# EasyEDA schematic NakujaN2.json

## Sheets
1 ESP: TITLE: Sheet_1; REV: 1.0; Date: 2022-04-05; Sheet: 1/1; Drawn By: Rodney Osodo; Company: Your Company
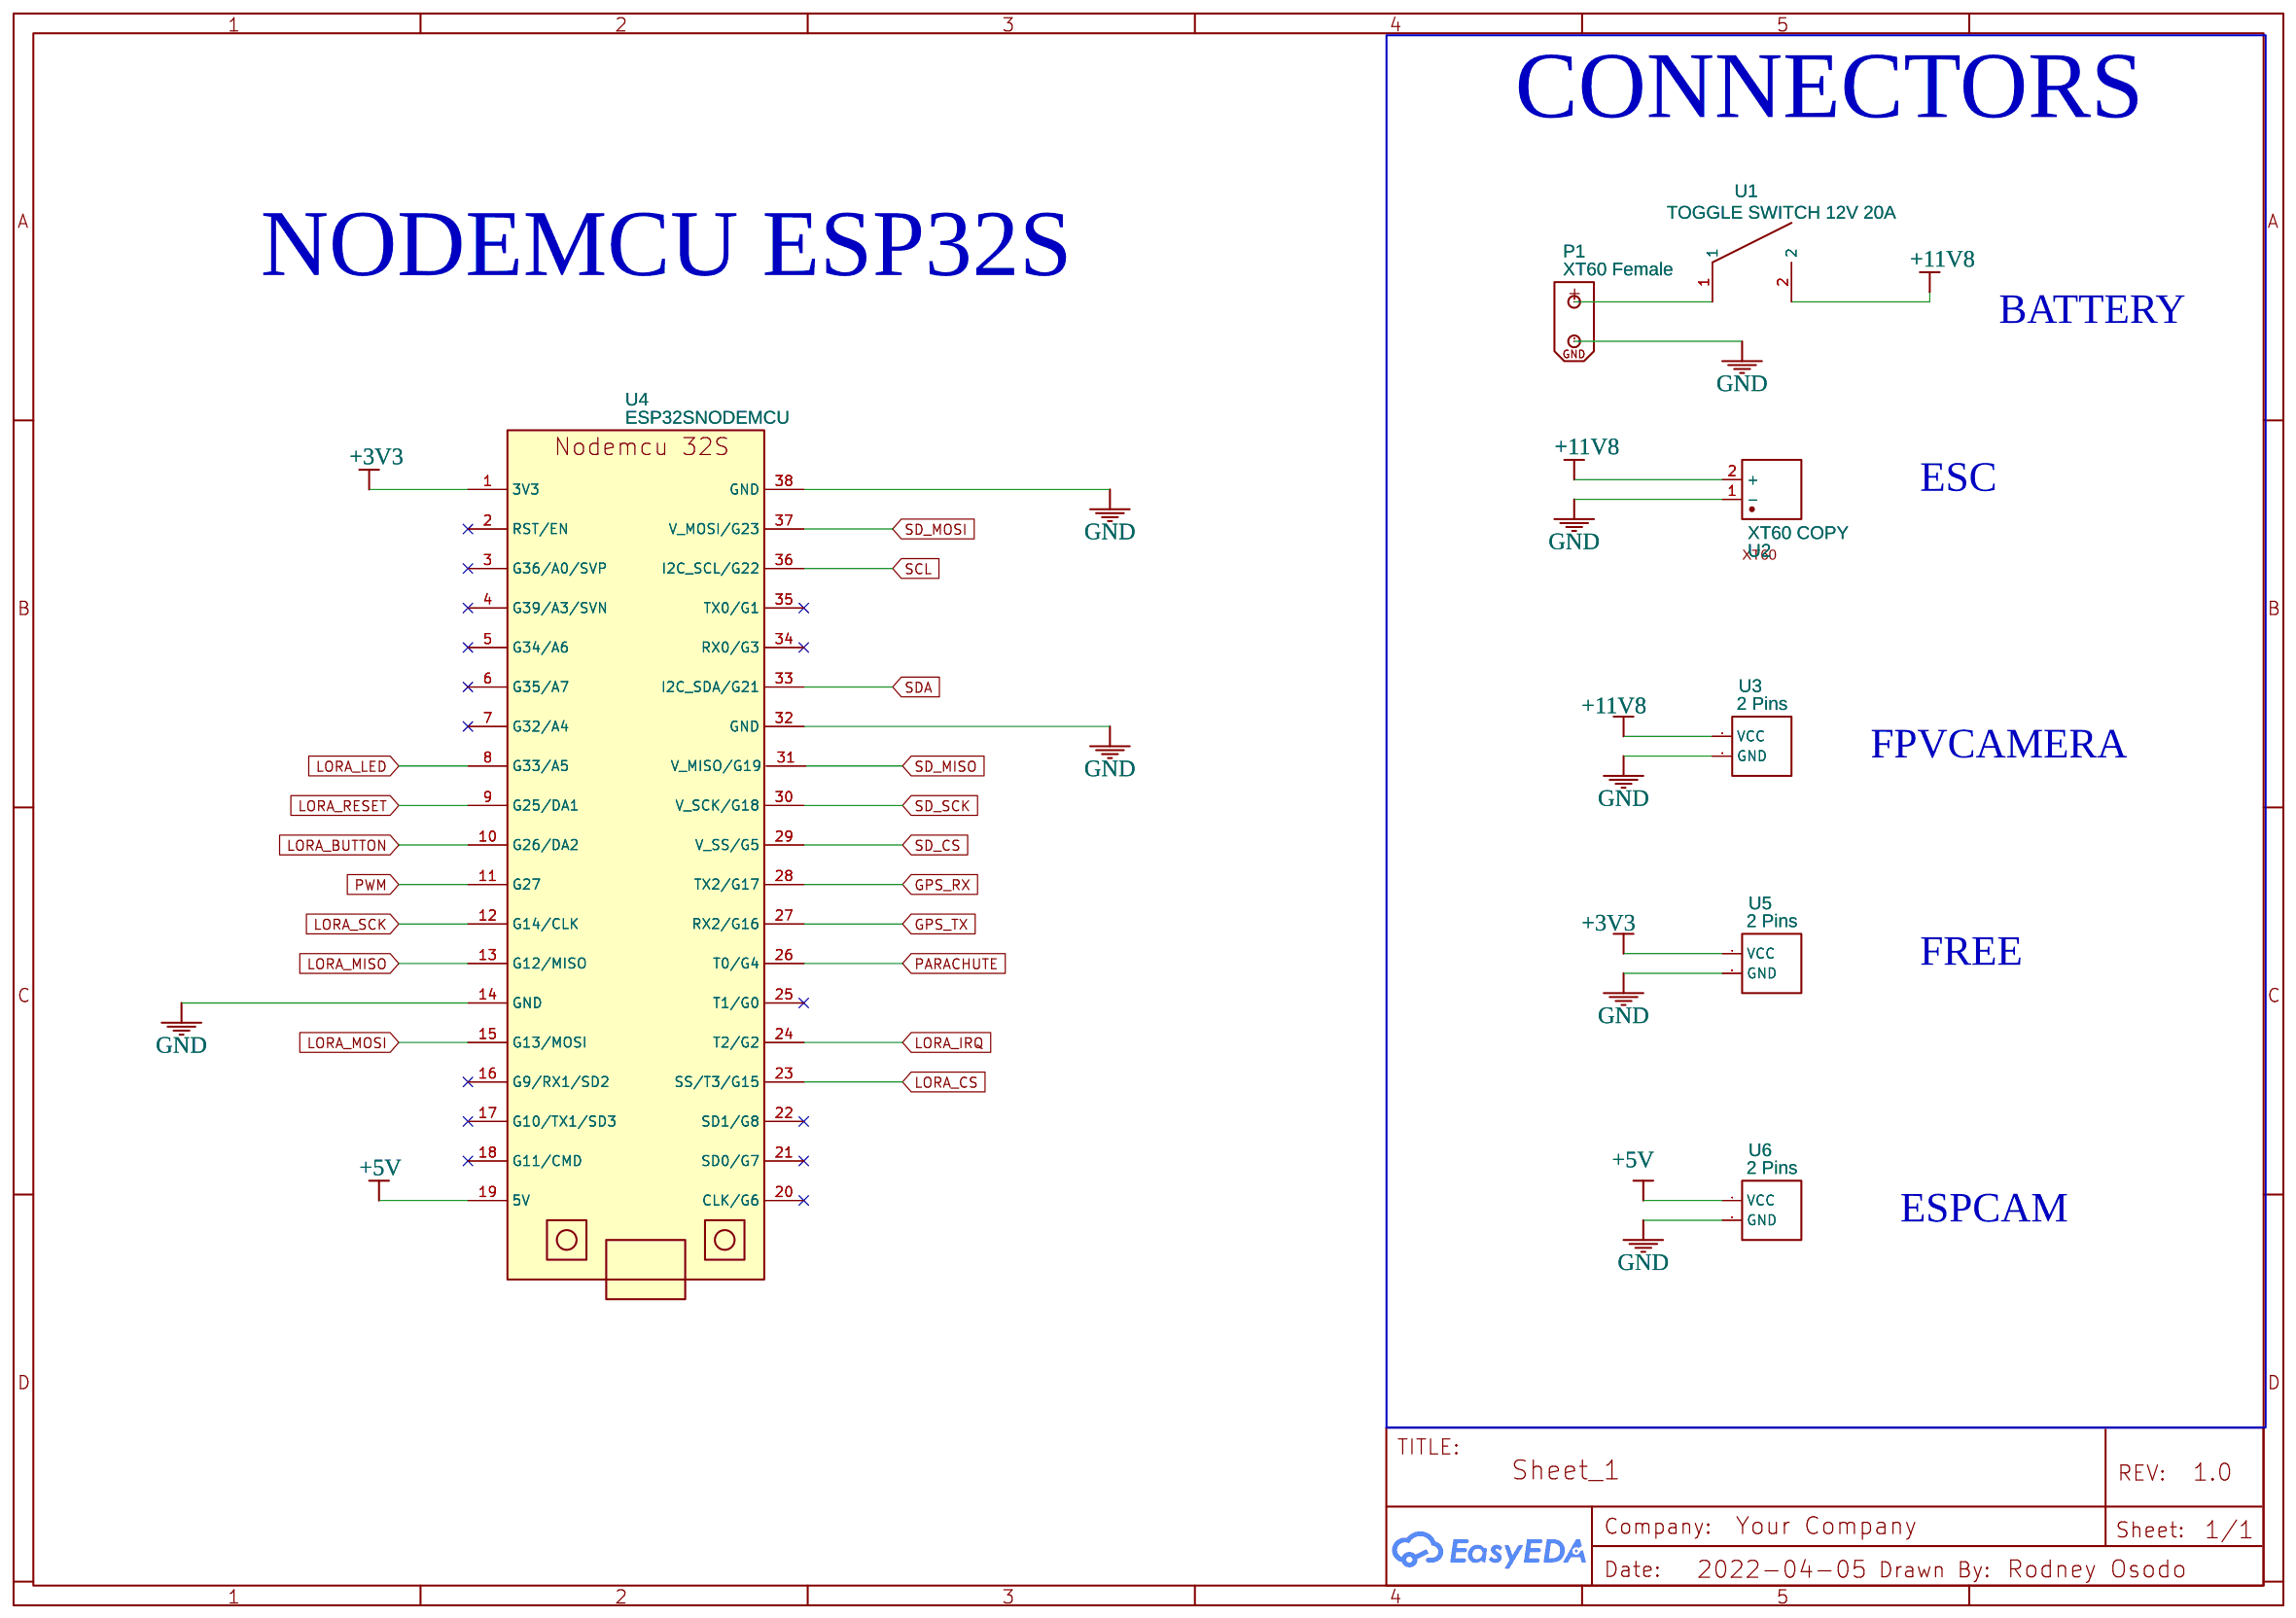
[diagram p0: ESP]
2 SENSORS
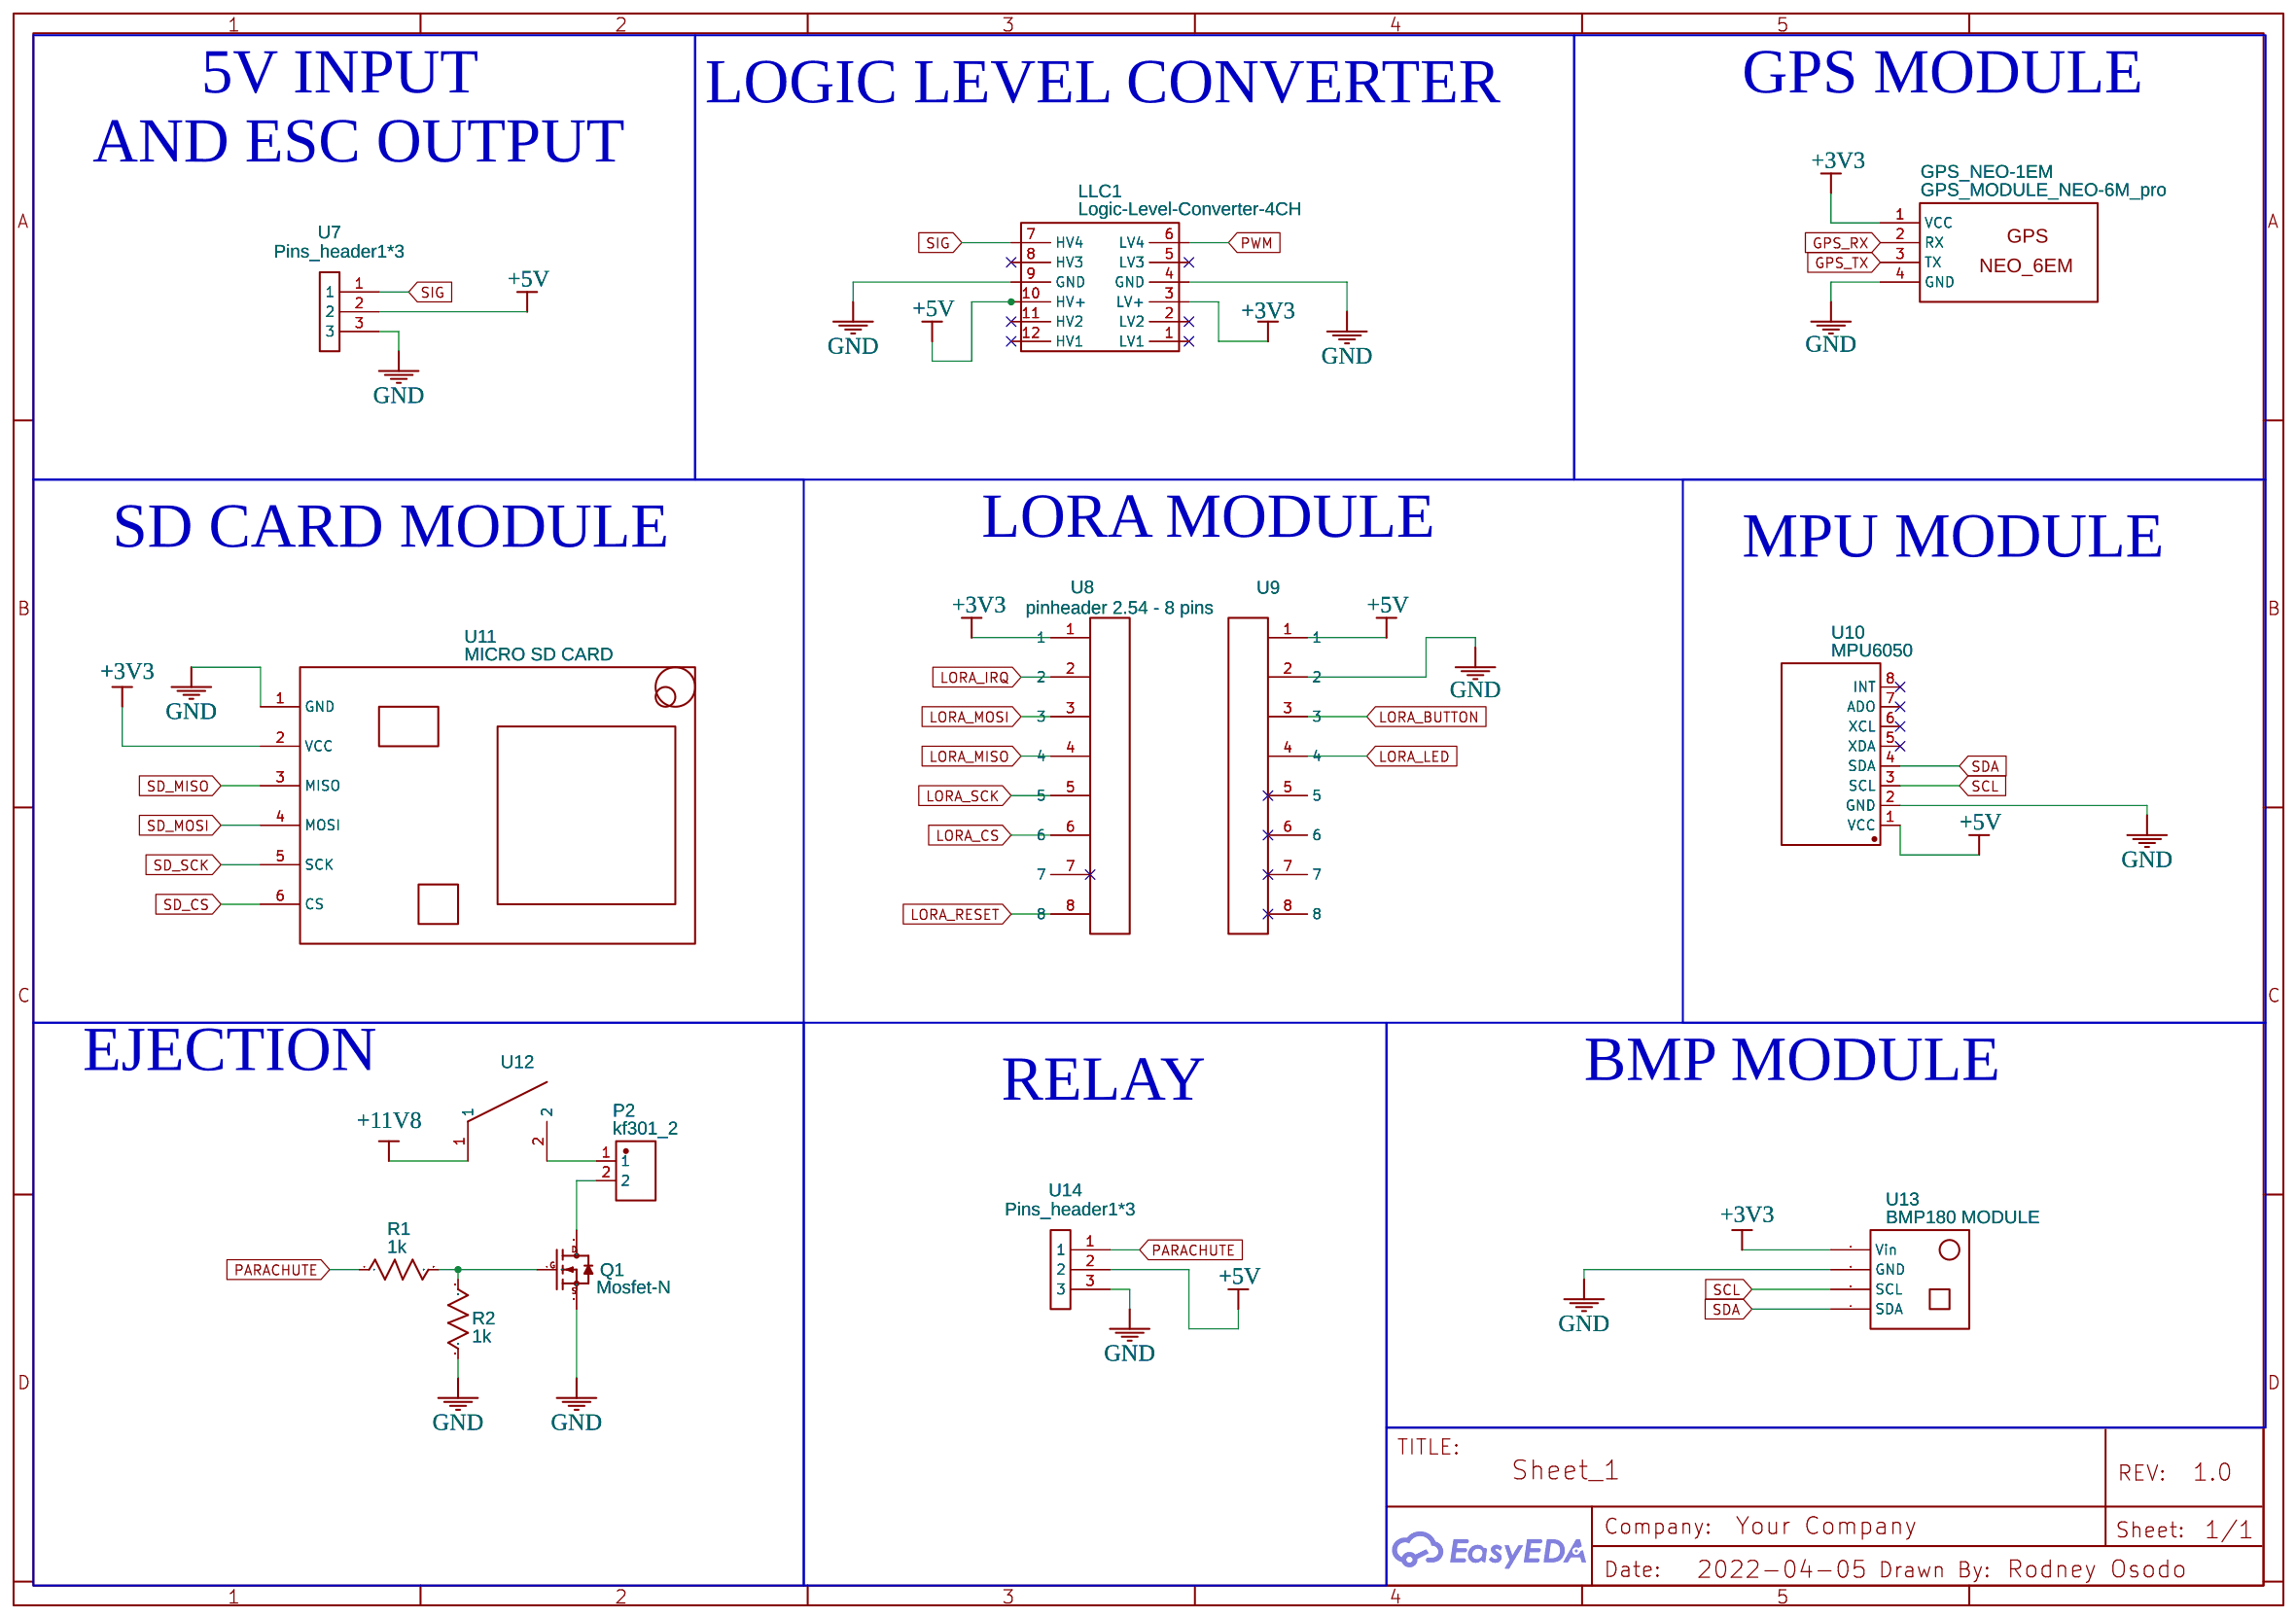
[diagram p1: SENSORS]

## Parts
sheet ESP
P1  XT60 Female  [XT60-F]
U1  TOGGLE SWITCH 12V 20A  [TOGGLE SWITCH 12V 20A]
U2  XT60 COPY  [XT60]
U3  2 Pins  [2 PINS HEADER]
U4  ESP32SNODEMCU  [NODEMCU-ESP32S]
U5  2 Pins  [2 PINS HEADER]
U6  2 Pins  [2 PINS HEADER]
sheet SENSORS
GPS_NEO-1EM  GPS_MODULE_NEO-6M_pro  [GPS_MODULE]
LLC1  Logic-Level-Converter-4CH  [LOGIC-LEVEL-CONVERTER-4CH]
P2  kf301_2  [KF301_2P]
Q1  Mosfet-N  [DC-MOSFET-TO-220]
R1  1k  [R_AXIAL-0.6]
R2  1k  [R_AXIAL-0.6]
U7  Pins_header1*3  [PINS_HEADER1*3]
U8  pinheader 2.54 - 8 pins  [PINHEADER 2.54 - 8 PINS]
U9  pinheader 2.54 - 8 pins  [PINHEADER 2.54 - 8 PINS]
U10  MPU6050  [MPU6050]
U11  MICRO SD CARD  [MICRO SD CARD]
U12  TOGGLE SWITCH 12V 20A  [TOGGLE SWITCH 12V 20A]
U13  BMP180 MODULE  [BMP180 MODULE (HW-596)]
U14  Pins_header1*3  [PINS_HEADER1*3]

## Library data of the parts
P1 = XT60 Female: Manufacturer: Changzhou Amass Elec; Contributor: rifanoz
U1 U12 = TOGGLE SWITCH 12V 20A: Contributor: Voldbirk
U2 = XT60 COPY: Contributor: Mitian
U3 U5 U6 = 2 Pins: Contributor: Uzain Yaseen
U4 = ESP32SNODEMCU: Manufacturer Part: Nodemcu esp32; Contributor: samlewis2406
GPS_NEO-1EM = GPS_MODULE_NEO-6M_pro: Contributor: Sanchezz2; sourceId: cy4mEWdvN
LLC1 = Logic-Level-Converter-4CH: Supplier Part: 50807; Supplier: Космодром; Contributor: Олег Мошник
P2 = kf301_2: Manufacturer: BOOMELE; image: //image.lceda.cn/szlcsc/C33435.jpg; Supplier Part: C33435; Contributor: rusrobot
Q1 = Mosfet-N: Contributor: dina
R1 R2 = R_AXIAL-0.6_US: Contributor: LCEDA_Lib
U7 U14 = Pins_header1*3: Contributor: Nattanan
U8 U9 = pinheader 2.54 - 8 pins: Contributor: pramodsreelakam
U10 = MPU6050: Supplier Part: GY521; Contributor: rahulaggarwal
U11 = MICRO SD CARD: Supplier: RS-Online; Contributor: SRY TIS
U13 = BMP180 MODULE: Manufacturer Part: BMP180 (HW-596); Contributor: esguti

## Nets
+3V3: GPS_NEO-1EM.1(VCC) LLC1.3(LV+) U4.1(3V3) U5.1(VCC) U8.1 U11.2(VCC) U13.1(Vin)
+5V: LLC1.10(HV+) U4.19(5V) U6.1(VCC) U7.2 U9.1 U10.1(VCC) U14.2
+11V8: U1.2 U2.2(+) U3.1(VCC) U12.1
GND: GPS_NEO-1EM.4(GND) LLC1.4(GND) LLC1.9(GND) P1.1 Q1.3(S) R2.1 U2.1(-) U3.2(GND) U4.14(GND) U4.32(GND) U4.38(GND) U5.2(GND) U6.2(GND) U7.3 U9.2 U10.2(GND) U11.1(GND) U13.2(GND) U14.3
GPS_RX: GPS_NEO-1EM.2(RX) U4.28(TX2/G17)
GPS_TX: GPS_NEO-1EM.3(TX) U4.27(RX2/G16)
LORA_BUTTON: U4.10(G26/DA2) U9.3
LORA_CS: U4.23(SS/T3/G15) U8.6
LORA_IRQ: U4.24(T2/G2) U8.2
LORA_LED: U4.8(G33/A5) U9.4
LORA_MISO: U4.13(G12/MISO) U8.4
LORA_MOSI: U4.15(G13/MOSI) U8.3
LORA_RESET: U4.9(G25/DA1) U8.8
LORA_SCK: U4.12(G14/CLK) U8.5
PARACHUTE: R1.1 U4.26(T0/G4) U14.1
PWM: LLC1.6(LV4) U4.11(G27)
SCL: U4.36(I2C SCL/G22) U10.3(SCL) U13.3(SCL)
SD_CS: U4.29(V_SS/G5) U11.6(CS)
SD_MISO: U4.31(V_MISO/G19) U11.3(MISO)
SD_MOSI: U4.37(V_MOSI/G23) U11.4(MOSI)
SD_SCK: U4.30(V_SCK/G18) U11.5(SCK)
SDA: U4.33(I2C SDA/G21) U10.4(SDA) U13.4(SDA)
SIG: LLC1.7(HV4) U7.1
Net-(P1-2): P1.2 U1.1
Net-(P2-1): P2.1 U12.2
Net-(P2-2): P2.2 Q1.2(D)
Net-(Q1-1): Q1.1(G) R1.2 R2.2

Not connected (* = marked no-connect by the designer): LLC1 1(LV1)* 2(LV2)* 5(LV3)* 8(HV3)* 11(HV2)* 12(HV1)*; U4 2(RST/EN)* 3(G36/A0/SVP)* 4(G39/A3/SVN)* 5(G34/A6)* 6(G35/A7)* 7(G32/A4)* 16(G9/RX1/SD2)* 17(G10/TX1/SD3)* 18(G11/CMD)* 20(CLK/G6)* 21(SD0/G7)* 22(SD1/G8)* 25(T1/G0)* 34(RX0/G3)* 35(TX0/G1)*; U8 7*; U9 5* 6* 7* 8*; U10 5(XDA)* 6(XCL)* 7(ADO)* 8(INT)*

## Notes on the sheets
sheet 1
- CONNECTORS
- NODEMCU ESP32S
- BATTERY
- ESC
- FPVCAMERA
- FREE
- ESPCAM
sheet 2
- 5V INPUT
- LOGIC LEVEL CONVERTER
- GPS MODULE
- AND ESC OUTPUT
- SD CARD MODULE
- LORA MODULE
- MPU MODULE
- EJECTION
- BMP MODULE
- RELAY
